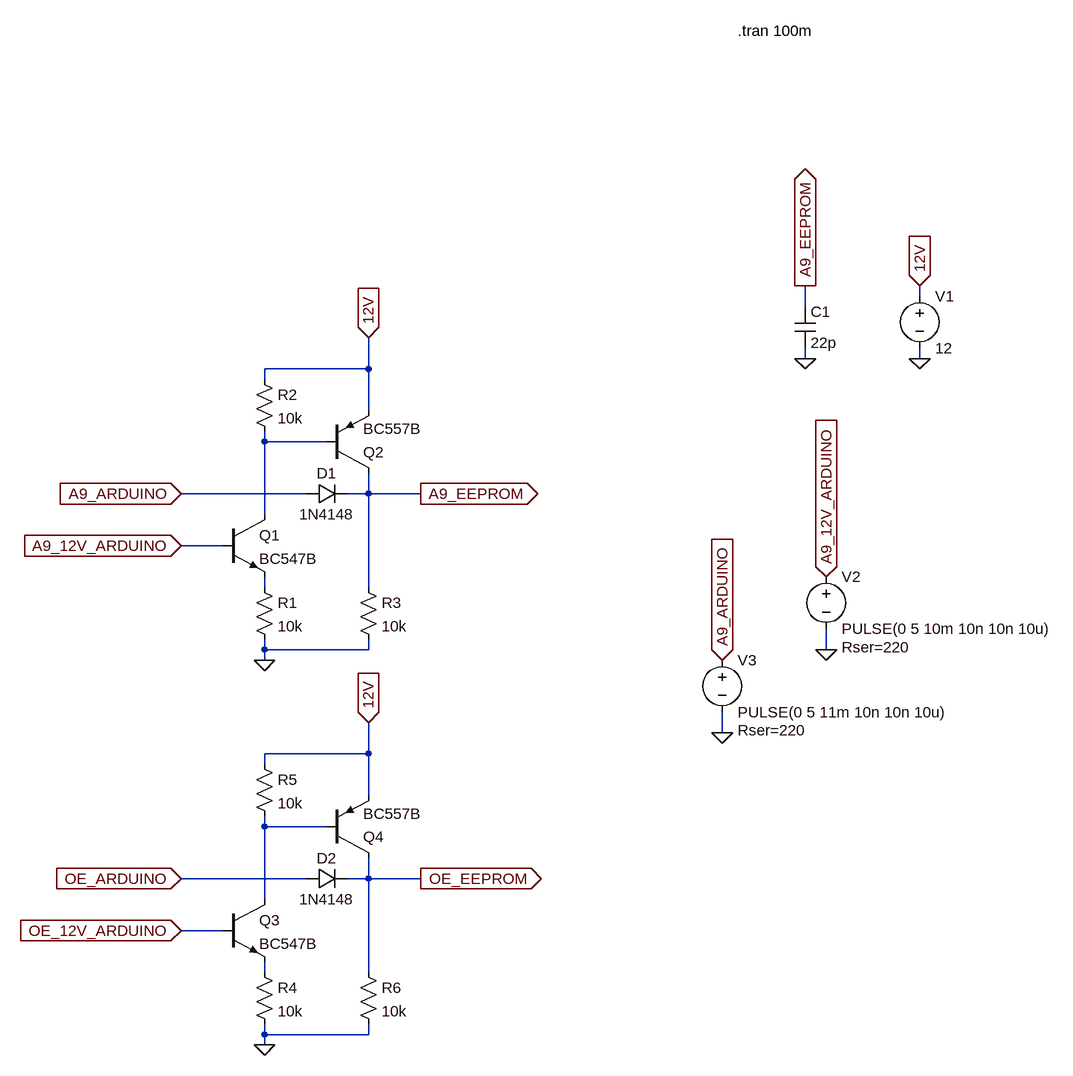
[diagram p0: schematic EEPROM programmer.asc]
EEPROM programmer.asc, the LTspice schematic file:
Version 4
SHEET 1 1440 948
WIRE 1216 -224 1216 -240
WIRE 1040 -208 1040 -240
WIRE 1040 -128 1040 -144
WIRE 1216 -128 1216 -144
WIRE 368 -112 368 -160
WIRE 368 -112 208 -112
WIRE 208 -96 208 -112
WIRE 368 -48 368 -112
WIRE 208 0 208 -16
WIRE 304 0 208 0
WIRE 272 80 80 80
WIRE 368 80 368 48
WIRE 368 80 336 80
WIRE 448 80 368 80
WIRE 208 112 208 0
WIRE 144 160 80 160
WIRE 208 224 208 208
WIRE 368 224 368 80
WIRE 208 320 208 304
WIRE 368 320 368 304
WIRE 368 320 208 320
WIRE 1072 320 1072 288
WIRE 208 336 208 320
WIRE 912 448 912 416
WIRE 368 480 368 432
WIRE 368 480 208 480
WIRE 208 496 208 480
WIRE 368 544 368 480
WIRE 208 592 208 576
WIRE 304 592 208 592
WIRE 272 672 80 672
WIRE 368 672 368 640
WIRE 368 672 336 672
WIRE 448 672 368 672
WIRE 208 704 208 592
WIRE 144 752 80 752
WIRE 208 816 208 800
WIRE 368 816 368 672
WIRE 208 912 208 896
WIRE 368 912 368 896
WIRE 368 912 208 912
WIRE 208 928 208 912
FLAG 208 336 0
FLAG 448 80 A9_EEPROM
IOPIN 448 80 Out
FLAG 80 80 A9_ARDUINO
IOPIN 80 80 In
FLAG 80 160 A9_12V_ARDUINO
IOPIN 80 160 In
FLAG 368 -160 12V
IOPIN 368 -160 In
FLAG 1040 -128 0
FLAG 1040 -240 A9_EEPROM
IOPIN 1040 -240 Out
FLAG 1216 -128 0
FLAG 1216 -240 12V
IOPIN 1216 -240 In
FLAG 1072 320 0
FLAG 912 448 0
FLAG 912 336 A9_ARDUINO
IOPIN 912 336 In
FLAG 1072 208 A9_12V_ARDUINO
IOPIN 1072 208 In
FLAG 208 928 0
FLAG 448 672 OE_EEPROM
IOPIN 448 672 Out
FLAG 80 672 OE_ARDUINO
IOPIN 80 672 In
FLAG 80 752 OE_12V_ARDUINO
IOPIN 80 752 In
FLAG 368 432 12V
IOPIN 368 432 In
SYMBOL npn 144 112 R0
SYMATTR InstName Q1
SYMATTR Value BC547B
SYMBOL res 192 208 R0
SYMATTR InstName R1
SYMATTR Value 10k
SYMBOL pnp 304 48 M180
SYMATTR InstName Q2
SYMATTR Value BC557B
SYMBOL res 192 -112 R0
SYMATTR InstName R2
SYMATTR Value 10k
SYMBOL diode 272 96 R270
WINDOW 0 32 32 VTop 2
WINDOW 3 0 32 VBottom 2
SYMATTR InstName D1
SYMATTR Value 1N4148
SYMBOL res 352 208 R0
SYMATTR InstName R3
SYMATTR Value 10k
SYMBOL cap 1024 -208 R0
SYMATTR InstName C1
SYMATTR Value 22p
SYMBOL voltage 1216 -240 R0
WINDOW 123 0 0 Left 0
WINDOW 39 0 0 Left 0
SYMATTR InstName V1
SYMATTR Value 12
SYMBOL voltage 1072 192 R0
WINDOW 123 0 0 Left 0
WINDOW 39 24 124 Left 2
SYMATTR SpiceLine Rser=220
SYMATTR InstName V2
SYMATTR Value PULSE(0 5 10m 10n 10n 10u)
SYMBOL voltage 912 320 R0
WINDOW 123 0 0 Left 0
WINDOW 39 24 124 Left 2
SYMATTR SpiceLine Rser=220
SYMATTR InstName V3
SYMATTR Value PULSE(0 5 11m 10n 10n 10u)
SYMBOL npn 144 704 R0
SYMATTR InstName Q3
SYMATTR Value BC547B
SYMBOL res 192 800 R0
SYMATTR InstName R4
SYMATTR Value 10k
SYMBOL pnp 304 640 M180
SYMATTR InstName Q4
SYMATTR Value BC557B
SYMBOL res 192 480 R0
SYMATTR InstName R5
SYMATTR Value 10k
SYMBOL diode 272 688 R270
WINDOW 0 32 32 VTop 2
WINDOW 3 0 32 VBottom 2
SYMATTR InstName D2
SYMATTR Value 1N4148
SYMBOL res 352 800 R0
SYMATTR InstName R6
SYMATTR Value 10k
TEXT 936 -632 Left 2 !.tran 100m

The netlist it stands for:
* EEPROM programmer.asc
Q1 N001 A9_12V_ARDUINO N002 0 BC547B
R1 N002 0 10k
Q2 A9_EEPROM N001 12V 0 BC557B
R2 12V N001 10k
D1 A9_ARDUINO A9_EEPROM 1N4148
R3 A9_EEPROM 0 10k
C1 A9_EEPROM 0 22p
V1 12V 0 12
V2 A9_12V_ARDUINO 0 PULSE(0 5 10m 10n 10n 10u) Rser=220
V3 A9_ARDUINO 0 PULSE(0 5 11m 10n 10n 10u) Rser=220
Q3 N003 OE_12V_ARDUINO N004 0 BC547B
R4 N004 0 10k
Q4 OE_EEPROM N003 12V 0 BC557B
R5 12V N003 10k
D2 OE_ARDUINO OE_EEPROM 1N4148
R6 OE_EEPROM 0 10k
.model D D
.lib standard.dio
.model NPN NPN
.model PNP PNP
.lib standard.bjt
.tran 100m
.backanno
.end